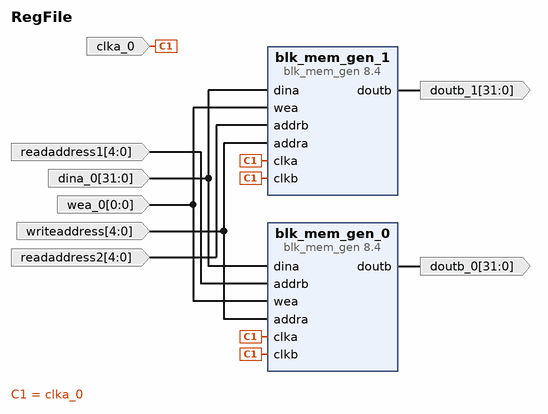
[diagram p0: block diagram of the top level]
# Vivado block design RegFile, xc7z010clg400-1, Vivado 2023.1
create_bd_design RegFile

create_bd_port -dir I -type clk clka_0
create_bd_port -dir I -from 31 -to 0 dina_0
create_bd_port -dir O -from 31 -to 0 doutb_0
create_bd_port -dir O -from 31 -to 0 doutb_1
create_bd_port -dir I -from 4 -to 0 writeaddress
create_bd_port -dir I -from 0 -to 0 wea_0
create_bd_port -dir I -from 4 -to 0 readaddress2
create_bd_port -dir I -from 4 -to 0 readaddress1

create_bd_cell -type ip -vlnv xilinx.com:ip:blk_mem_gen:8.4 blk_mem_gen_0
set_property -dict [list \
  CONFIG.Assume_Synchronous_Clk true \
  CONFIG.Coe_File regfileinit.coe \
  CONFIG.Enable_32bit_Address false \
  CONFIG.Enable_A Always_Enabled \
  CONFIG.Enable_B Always_Enabled \
  CONFIG.Fill_Remaining_Memory_Locations false \
  CONFIG.Load_Init_File true \
  CONFIG.Memory_Type Simple_Dual_Port_RAM \
  CONFIG.Register_PortB_Output_of_Memory_Primitives false \
  CONFIG.Use_RSTB_Pin false \
  CONFIG.Write_Depth_A 32 \
  CONFIG.use_bram_block Stand_Alone \
] [get_bd_cells blk_mem_gen_0]
create_bd_cell -type ip -vlnv xilinx.com:ip:blk_mem_gen:8.4 blk_mem_gen_1
set_property -dict [list \
  CONFIG.Assume_Synchronous_Clk true \
  CONFIG.Coe_File ../RegFile_blk_mem_gen_0_0/regfileinit.coe \
  CONFIG.Enable_32bit_Address false \
  CONFIG.Enable_A Always_Enabled \
  CONFIG.Enable_B Always_Enabled \
  CONFIG.Fill_Remaining_Memory_Locations false \
  CONFIG.Load_Init_File true \
  CONFIG.Memory_Type Simple_Dual_Port_RAM \
  CONFIG.Register_PortB_Output_of_Memory_Primitives false \
  CONFIG.Use_RSTB_Pin false \
  CONFIG.Write_Depth_A 32 \
  CONFIG.use_bram_block Stand_Alone \
] [get_bd_cells blk_mem_gen_1]

# ---- connections ----

connect_bd_net -net addrb_0_1 [get_bd_ports readaddress1] [get_bd_pins blk_mem_gen_0/addrb]
connect_bd_net [get_bd_pins blk_mem_gen_0/doutb] [get_bd_ports doutb_0]
connect_bd_net [get_bd_pins blk_mem_gen_1/doutb] [get_bd_ports doutb_1]
connect_bd_net -net clka_0_1 [get_bd_ports clka_0] \
  [get_bd_pins blk_mem_gen_0/clka] [get_bd_pins blk_mem_gen_0/clkb] [get_bd_pins blk_mem_gen_1/clka] \
  [get_bd_pins blk_mem_gen_1/clkb]
connect_bd_net -net dina_0_1 [get_bd_ports dina_0] [get_bd_pins blk_mem_gen_0/dina] [get_bd_pins blk_mem_gen_1/dina]
connect_bd_net -net readaddress2_1 [get_bd_ports readaddress2] [get_bd_pins blk_mem_gen_1/addrb]
connect_bd_net -net wea_0_1 [get_bd_ports wea_0] [get_bd_pins blk_mem_gen_0/wea] [get_bd_pins blk_mem_gen_1/wea]
connect_bd_net [get_bd_ports writeaddress] [get_bd_pins blk_mem_gen_0/addra] [get_bd_pins blk_mem_gen_1/addra]

validate_bd_design
save_bd_design
